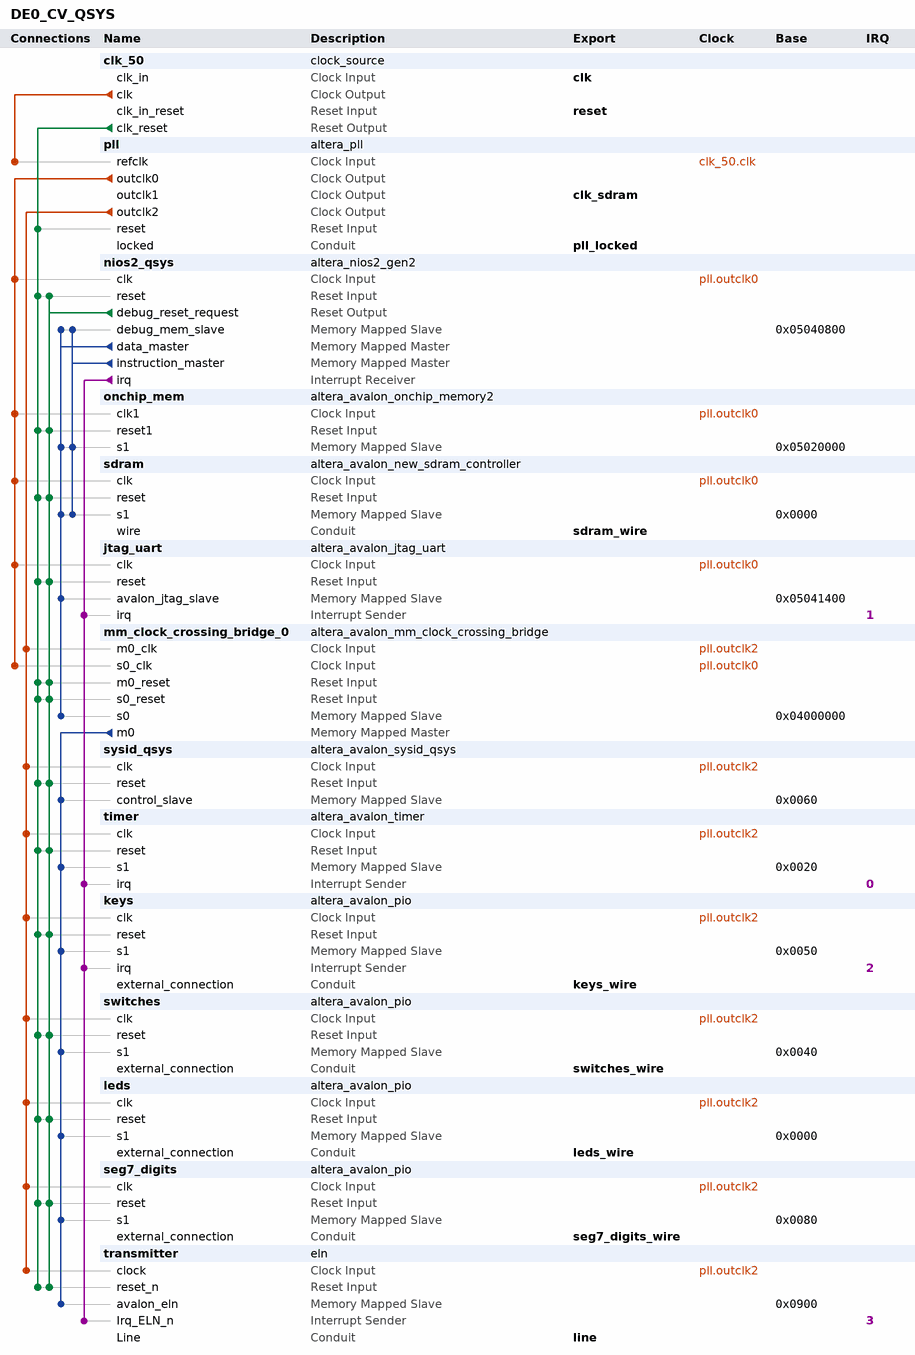
[diagram p0: system contents]
# Platform Designer (Qsys) system DE0_CV_QSYS, Cyclone V 5CEBA4F23C7
# Parameters at their usual value, and those the tool derives, are not listed.
package require -exact qsys 17.0
create_system DE0_CV_QSYS
set_project_property DEVICE_FAMILY {Cyclone V}
set_project_property DEVICE 5CEBA4F23C7

add_instance clk_50 clock_source 17.0
set_instance_parameter_value clk_50 clockFrequency 50000000

add_instance pll altera_pll 17.0
set_instance_parameter_value pll gui_device_speed_grade 2
set_instance_parameter_value pll gui_number_of_clocks 3
set_instance_parameter_value pll gui_operation_mode normal
set_instance_parameter_value pll gui_output_clock_frequency0 143.0
set_instance_parameter_value pll gui_output_clock_frequency1 143.0
set_instance_parameter_value pll gui_output_clock_frequency2 1.5
set_instance_parameter_value pll gui_phase_shift1 -3800
set_instance_parameter_value pll gui_phase_shift_deg1 -90.0
set_instance_parameter_value pll gui_pll_mode {Integer-N PLL}
set_instance_parameter_value pll gui_reference_clock_frequency 50.0
set_instance_parameter_value pll gui_use_locked true

add_instance nios2_qsys altera_nios2_gen2 17.0
set_instance_parameter_value nios2_qsys dcache_size 2048
set_instance_parameter_value nios2_qsys exceptionSlave onchip_mem.s1
set_instance_parameter_value nios2_qsys icache_size 4096
set_instance_parameter_value nios2_qsys impl Fast
set_instance_parameter_value nios2_qsys resetSlave onchip_mem.s1
set_instance_parameter_value nios2_qsys setting_shadowRegisterSets 1

add_instance onchip_mem altera_avalon_onchip_memory2 17.0
set_instance_parameter_value onchip_mem dataWidth 32
set_instance_parameter_value onchip_mem dualPort false
set_instance_parameter_value onchip_mem initMemContent true
set_instance_parameter_value onchip_mem initializationFileName onchip_mem.hex
set_instance_parameter_value onchip_mem memorySize 128000

add_instance sdram altera_avalon_new_sdram_controller 17.0
set_instance_parameter_value sdram TAC 5.4
set_instance_parameter_value sdram TRCD 15.0
set_instance_parameter_value sdram TRP 15.0
set_instance_parameter_value sdram casLatency 3
set_instance_parameter_value sdram columnWidth 10
set_instance_parameter_value sdram dataWidth 16
set_instance_parameter_value sdram generateSimulationModel true
set_instance_parameter_value sdram model single_Micron_MT48LC4M32B2_7_chip
set_instance_parameter_value sdram numberOfBanks 4
set_instance_parameter_value sdram numberOfChipSelects 1
set_instance_parameter_value sdram powerUpDelay 100.0
set_instance_parameter_value sdram refreshPeriod 7.8125
set_instance_parameter_value sdram rowWidth 13

add_instance jtag_uart altera_avalon_jtag_uart 17.0
set_instance_parameter_value jtag_uart simInteractiveOptions NO_INTERACTIVE_WINDOWS

add_instance mm_clock_crossing_bridge_0 altera_avalon_mm_clock_crossing_bridge 17.0
set_instance_parameter_value mm_clock_crossing_bridge_0 ADDRESS_WIDTH 12
set_instance_parameter_value mm_clock_crossing_bridge_0 COMMAND_FIFO_DEPTH 4
set_instance_parameter_value mm_clock_crossing_bridge_0 DATA_WIDTH 32
set_instance_parameter_value mm_clock_crossing_bridge_0 MASTER_SYNC_DEPTH 2
set_instance_parameter_value mm_clock_crossing_bridge_0 MAX_BURST_SIZE 1
set_instance_parameter_value mm_clock_crossing_bridge_0 RESPONSE_FIFO_DEPTH 4
set_instance_parameter_value mm_clock_crossing_bridge_0 SLAVE_SYNC_DEPTH 2
set_instance_parameter_value mm_clock_crossing_bridge_0 USE_AUTO_ADDRESS_WIDTH 0

add_instance sysid_qsys altera_avalon_sysid_qsys 17.0
set_instance_parameter_value sysid_qsys id -889266486

add_instance timer altera_avalon_timer 17.0
set_instance_parameter_value timer period 1
set_instance_parameter_value timer periodUnits MSEC

add_instance keys altera_avalon_pio 17.0
set_instance_parameter_value keys captureEdge true
set_instance_parameter_value keys direction Input
set_instance_parameter_value keys edgeType FALLING
set_instance_parameter_value keys generateIRQ true
set_instance_parameter_value keys irqType EDGE
set_instance_parameter_value keys width 4

add_instance switches altera_avalon_pio 17.0
set_instance_parameter_value switches direction Input
set_instance_parameter_value switches width 10

add_instance leds altera_avalon_pio 17.0
set_instance_parameter_value leds bitModifyingOutReg true
set_instance_parameter_value leds direction Output
set_instance_parameter_value leds width 10

add_instance seg7_digits altera_avalon_pio 17.0
set_instance_parameter_value seg7_digits bitModifyingOutReg true
set_instance_parameter_value seg7_digits direction Output
set_instance_parameter_value seg7_digits width 24

add_instance transmitter eln 1.0

# connections
add_connection clk_50.clk pll.refclk clock
add_connection pll.outclk0 jtag_uart.clk clock
add_connection pll.outclk0 mm_clock_crossing_bridge_0.s0_clk clock
add_connection pll.outclk0 nios2_qsys.clk clock
add_connection pll.outclk0 onchip_mem.clk1 clock
add_connection pll.outclk0 sdram.clk clock
add_connection pll.outclk2 keys.clk clock
add_connection pll.outclk2 leds.clk clock
add_connection pll.outclk2 mm_clock_crossing_bridge_0.m0_clk clock
add_connection pll.outclk2 seg7_digits.clk clock
add_connection pll.outclk2 switches.clk clock
add_connection pll.outclk2 sysid_qsys.clk clock
add_connection pll.outclk2 timer.clk clock
add_connection pll.outclk2 transmitter.clock clock
add_connection clk_50.clk_reset jtag_uart.reset reset
add_connection clk_50.clk_reset keys.reset reset
add_connection clk_50.clk_reset leds.reset reset
add_connection clk_50.clk_reset mm_clock_crossing_bridge_0.m0_reset reset
add_connection clk_50.clk_reset mm_clock_crossing_bridge_0.s0_reset reset
add_connection clk_50.clk_reset nios2_qsys.reset reset
add_connection clk_50.clk_reset onchip_mem.reset1 reset
add_connection clk_50.clk_reset pll.reset reset
add_connection clk_50.clk_reset sdram.reset reset
add_connection clk_50.clk_reset seg7_digits.reset reset
add_connection clk_50.clk_reset switches.reset reset
add_connection clk_50.clk_reset sysid_qsys.reset reset
add_connection clk_50.clk_reset timer.reset reset
add_connection clk_50.clk_reset transmitter.reset_n reset
add_connection nios2_qsys.debug_reset_request jtag_uart.reset reset
add_connection nios2_qsys.debug_reset_request keys.reset reset
add_connection nios2_qsys.debug_reset_request leds.reset reset
add_connection nios2_qsys.debug_reset_request mm_clock_crossing_bridge_0.m0_reset reset
add_connection nios2_qsys.debug_reset_request mm_clock_crossing_bridge_0.s0_reset reset
add_connection nios2_qsys.debug_reset_request nios2_qsys.reset reset
add_connection nios2_qsys.debug_reset_request onchip_mem.reset1 reset
add_connection nios2_qsys.debug_reset_request sdram.reset reset
add_connection nios2_qsys.debug_reset_request seg7_digits.reset reset
add_connection nios2_qsys.debug_reset_request switches.reset reset
add_connection nios2_qsys.debug_reset_request sysid_qsys.reset reset
add_connection nios2_qsys.debug_reset_request timer.reset reset
add_connection nios2_qsys.debug_reset_request transmitter.reset_n reset
add_connection mm_clock_crossing_bridge_0.m0 keys.s1 avalon
set_connection_parameter_value mm_clock_crossing_bridge_0.m0/keys.s1 baseAddress 0x0050
add_connection mm_clock_crossing_bridge_0.m0 leds.s1 avalon
set_connection_parameter_value mm_clock_crossing_bridge_0.m0/leds.s1 baseAddress 0x0000
add_connection mm_clock_crossing_bridge_0.m0 seg7_digits.s1 avalon
set_connection_parameter_value mm_clock_crossing_bridge_0.m0/seg7_digits.s1 baseAddress 0x0080
add_connection mm_clock_crossing_bridge_0.m0 switches.s1 avalon
set_connection_parameter_value mm_clock_crossing_bridge_0.m0/switches.s1 baseAddress 0x0040
add_connection mm_clock_crossing_bridge_0.m0 sysid_qsys.control_slave avalon
set_connection_parameter_value mm_clock_crossing_bridge_0.m0/sysid_qsys.control_slave baseAddress 0x0060
add_connection mm_clock_crossing_bridge_0.m0 timer.s1 avalon
set_connection_parameter_value mm_clock_crossing_bridge_0.m0/timer.s1 baseAddress 0x0020
add_connection mm_clock_crossing_bridge_0.m0 transmitter.avalon_eln avalon
set_connection_parameter_value mm_clock_crossing_bridge_0.m0/transmitter.avalon_eln baseAddress 0x0900
add_connection nios2_qsys.data_master jtag_uart.avalon_jtag_slave avalon
set_connection_parameter_value nios2_qsys.data_master/jtag_uart.avalon_jtag_slave baseAddress 0x05041400
add_connection nios2_qsys.data_master mm_clock_crossing_bridge_0.s0 avalon
set_connection_parameter_value nios2_qsys.data_master/mm_clock_crossing_bridge_0.s0 baseAddress 0x04000000
add_connection nios2_qsys.data_master nios2_qsys.debug_mem_slave avalon
set_connection_parameter_value nios2_qsys.data_master/nios2_qsys.debug_mem_slave baseAddress 0x05040800
add_connection nios2_qsys.data_master onchip_mem.s1 avalon
set_connection_parameter_value nios2_qsys.data_master/onchip_mem.s1 baseAddress 0x05020000
add_connection nios2_qsys.data_master sdram.s1 avalon
set_connection_parameter_value nios2_qsys.data_master/sdram.s1 baseAddress 0x0000
add_connection nios2_qsys.instruction_master nios2_qsys.debug_mem_slave avalon
set_connection_parameter_value nios2_qsys.instruction_master/nios2_qsys.debug_mem_slave baseAddress 0x05040800
add_connection nios2_qsys.instruction_master onchip_mem.s1 avalon
set_connection_parameter_value nios2_qsys.instruction_master/onchip_mem.s1 baseAddress 0x05020000
add_connection nios2_qsys.instruction_master sdram.s1 avalon
set_connection_parameter_value nios2_qsys.instruction_master/sdram.s1 baseAddress 0x0000
add_connection nios2_qsys.irq jtag_uart.irq interrupt
set_connection_parameter_value nios2_qsys.irq/jtag_uart.irq irqNumber 1
add_connection nios2_qsys.irq keys.irq interrupt
set_connection_parameter_value nios2_qsys.irq/keys.irq irqNumber 2
add_connection nios2_qsys.irq timer.irq interrupt
set_connection_parameter_value nios2_qsys.irq/timer.irq irqNumber 0
add_connection nios2_qsys.irq transmitter.Irq_ELN_n interrupt
set_connection_parameter_value nios2_qsys.irq/transmitter.Irq_ELN_n irqNumber 3

# exported interfaces
add_interface clk clock sink
set_interface_property clk EXPORT_OF clk_50.clk_in
add_interface clk_sdram clock source
set_interface_property clk_sdram EXPORT_OF pll.outclk1
add_interface keys_wire conduit end
set_interface_property keys_wire EXPORT_OF keys.external_connection
add_interface leds_wire conduit end
set_interface_property leds_wire EXPORT_OF leds.external_connection
add_interface line conduit end
set_interface_property line EXPORT_OF transmitter.Line
add_interface pll_locked conduit end
set_interface_property pll_locked EXPORT_OF pll.locked
add_interface reset reset sink
set_interface_property reset EXPORT_OF clk_50.clk_in_reset
add_interface sdram_wire conduit end
set_interface_property sdram_wire EXPORT_OF sdram.wire
add_interface seg7_digits_wire conduit end
set_interface_property seg7_digits_wire EXPORT_OF seg7_digits.external_connection
add_interface switches_wire conduit end
set_interface_property switches_wire EXPORT_OF switches.external_connection

set_interconnect_requirement {$system} qsys_mm.clockCrossingAdapter HANDSHAKE
set_interconnect_requirement {$system} qsys_mm.maxAdditionalLatency 1

save_system DE0_CV_QSYS.qsys
